# EAGLE schematic snake_game (EAGLE 6.3)
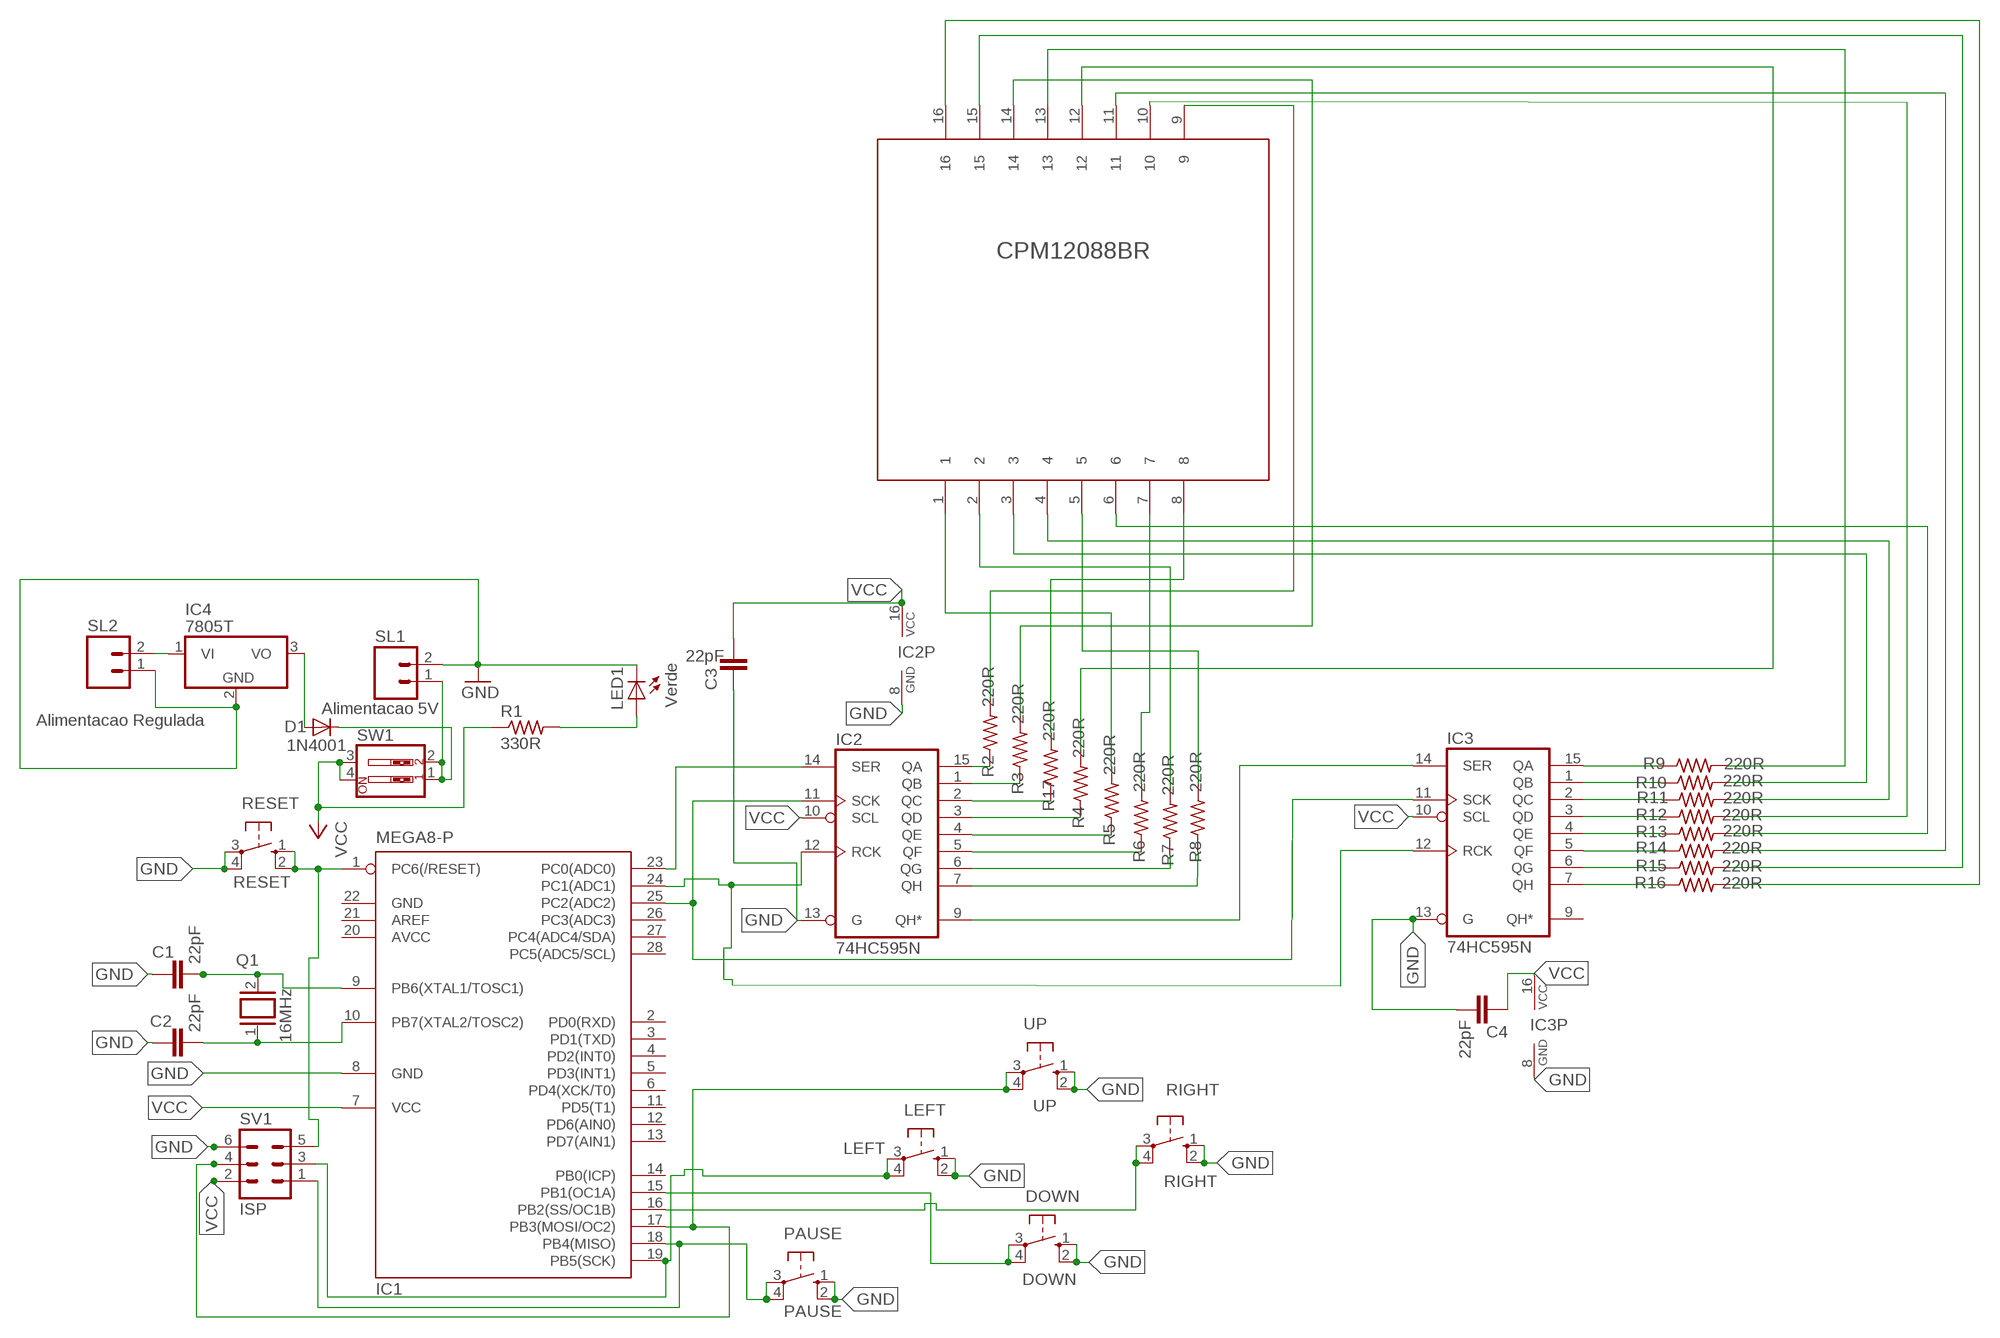
[diagram p0: schematic, sheet 1]

## Parts
C1  22pF  C2.5/2  [C2.5-2]
C2  22pF  C2.5/2  [C2.5-2]
C3  22pF  C2.5/2  [C2.5-2]
C4  22pF  C2.5/2  [C2.5-2]
D1  1N4001  1N4004  [DO41-10]
DOWN  DOWN  10-XX  [B3F-10XX]
IC1  MEGA8-P  [DIL28-3]
IC2  74HC595N  [DIL16]
IC3  74HC595N  [DIL16]
IC4  7805T  [TO220H]
LED1  Verde  LED3MM  [LED3MM]
LEFT  LEFT  10-XX  [B3F-10XX]
MTX1  LED_DOT_MATRIX_8X8_CPM12088B  [MATRIX_8X8_CPM12088B]
PAUSE  PAUSE  10-XX  [B3F-10XX]
Q1  16MHz  XTAL/S  [QS]
R1  330R  R-US_0207/10  [0207/10]
R2  220R  R-US_0207/10  [0207/10]
R3  220R  R-US_0207/10  [0207/10]
R4  220R  R-US_0207/10  [0207/10]
R5  220R  R-US_0207/10  [0207/10]
R6  220R  R-US_0207/10  [0207/10]
R7  220R  R-US_0207/10  [0207/10]
R8  220R  R-US_0207/10  [0207/10]
R9  220R  R-US_0207/10  [0207/10]
R10  220R  R-US_0207/10  [0207/10]
R11  220R  R-US_0207/10  [0207/10]
R12  220R  R-US_0207/10  [0207/10]
R13  220R  R-US_0207/10  [0207/10]
R14  220R  R-US_0207/10  [0207/10]
R15  220R  R-US_0207/10  [0207/10]
R16  220R  R-US_0207/10  [0207/10]
R17  220R  R-US_0207/10  [0207/10]
RESET  RESET  10-XX  [B3F-10XX]
RIGHT  RIGHT  10-XX  [B3F-10XX]
SL1  Alimentacao 5V  M02  [02P]
SL2  Alimentacao Regulada  M02  [02P]
SV1  ISP  ML6  [ML6]
SW1  SW_DIP-2  [EDG-02]
UP  UP  10-XX  [B3F-10XX]

## Nets
GND: C1.1 C2.1 C3.1 C4.2 DOWN.1(S) DOWN.2(S1) IC1.8(GND) IC2.8(GND) IC2.13(G) IC3.8(GND) IC3.13(G) IC4.2(GND) LED1.K(C) LEFT.1(S) LEFT.2(S1) PAUSE.1(S) PAUSE.2(S1) RESET.3(P) RESET.4(P1) RIGHT.1(S) RIGHT.2(S1) SL1.2 SL2.1 SV1.6 UP.1(S) UP.2(S1)
N$1: MTX1.9 R2.2
N$2: IC1.1(PC6(/RESET)) RESET.1(S) RESET.2(S1) SV1.5
N$3: C2.2 IC1.10(PB7(XTAL2/TOSC2)) Q1.1
N$4: C1.2 IC1.9(PB6(XTAL1/TOSC1)) Q1.2
N$5: IC1.19(PB5(SCK)) LEFT.3(P) LEFT.4(P1) SV1.3
N$7: DOWN.3(P) DOWN.4(P1) IC1.15(PB1(OC1A))
N$9: IC1.16(PB2(SS/OC1B)) RIGHT.3(P) RIGHT.4(P1)
N$11: IC1.17(PB3(MOSI/OC2)) SV1.4 UP.3(P) UP.4(P1)
N$12: IC4.1(VI) SL2.2
N$13: IC1.18(PB4(MISO)) PAUSE.3(P) PAUSE.4(P1) SV1.1
N$14: D1.A IC4.3(VO)
N$15: IC1.23(PC0(ADC0)) IC2.14(SER)
N$16: IC1.24(PC1(ADC1)) IC2.12(RCK) IC3.12(RCK)
N$17: IC1.25(PC2(ADC2)) IC2.11(SCK) IC3.11(SCK)
N$18: D1.C SL1.1 SW1.1 SW1.2
N$19: LED1.A R1.2
N$20: IC2.9(QH*) IC3.14(SER)
N$21: MTX1.14 R3.2
N$22: MTX1.8 R17.2
N$23: MTX1.12 R4.2
N$24: MTX1.1 R5.2
N$25: MTX1.7 R6.2
N$26: MTX1.2 R7.2
N$27: IC2.7(QH) R8.1
N$28: MTX1.13 R9.2
N$29: MTX1.3 R10.2
N$30: MTX1.4 R11.2
N$31: MTX1.10 R12.2
N$32: MTX1.6 R13.2
N$33: MTX1.11 R14.2
N$34: MTX1.15 R15.2
N$35: MTX1.16 R16.2
N$36: IC3.7(QH) R16.1
N$37: IC2.15(QA) R2.1
N$38: IC3.6(QG) R15.1
N$39: IC3.5(QF) R14.1
N$40: IC3.4(QE) R13.1
N$41: IC3.3(QD) R12.1
N$42: IC3.2(QC) R11.1
N$43: IC3.1(QB) R10.1
N$44: IC3.15(QA) R9.1
N$45: IC2.1(QB) R3.1
N$46: IC2.3(QD) R4.1
N$47: IC2.4(QE) R5.1
N$48: IC2.5(QF) R6.1
N$49: IC2.6(QG) R7.1
N$50: MTX1.5 R8.2
N$51: IC2.2(QC) R17.1
VCC: C3.2 C4.1 IC1.7(VCC) IC2.10(SCL) IC2.16(VCC) IC3.10(SCL) IC3.16(VCC) R1.1 SV1.2 SW1.3 SW1.4
Unconnected: IC1.2(PD0(RXD)) IC1.3(PD1(TXD)) IC1.4(PD2(INT0)) IC1.5(PD3(INT1)) IC1.6(PD4(XCK/T0)) IC1.11(PD5(T1)) IC1.12(PD6(AIN0)) IC1.13(PD7(AIN1)) IC1.14(PB0(ICP)) IC1.21(AREF) IC1.26(PC3(ADC3)) IC1.27(PC4(ADC4/SDA)) IC1.28(PC5(ADC5/SCL)) IC3.9(QH*)

## Power pins joined to a net without a drawn wire
AVCC: IC1.20(AVCC)
GND: IC1.22(GND)

## Library data of the parts
C1-C4 = capacitor-wima:C: CAPACITOR naming: grid - package width
D1 = diode:1N4004: DIODE general purpose rectifier, 1 A
DOWN LEFT PAUSE RESET RIGHT UP = switch-omron:10-XX: OMRON SWITCH; MPN: B3F-1000; OC_FARNELL: 176432; OC_NEWARK: 36M3542
IC1 = atmel:MEGA8-P: MICROCONTROLLER 8 Kbytes FLASH, 1 kbytes SRAM, 512 bytes EEPROM, USART, 4-channel 10 bit ADC, 2-channel 8 bit ADC Pin compatible with Atmega48, ATMega88, ATMega168 Source: avr.lbr; OC_FARNELL: unknown; OC_NEWARK: unknown
IC2 IC3 = 74xx-eu:74*595: 8-bit SHIFT REGISTER, output latch
IC4 = linear:78*: Positive VOLTAGE REGULATOR Source: http://cache.national.com/ds/LM/LM78L05.pdf http://www.fairchildsemi.com/ds/LM/LM7805.pdf
LED1 = led:LED: LED OSRAM: - CHIPLED LG R971, LG N971, LY N971, LG Q971, LY Q971, LO R971, LY R971 LH N974, LH R974 LS Q976, LO Q976, LY Q976 LO Q996 - Hyper CHIPLED LW Q18S LB Q993, LB Q99A, LB R99A - SideLED LS A670, LO A670, LY A670, LG A670, LP A670 LB A673, LV A673, LT A673, LW A673 LH A674 LY A675 LS A676, LA A676, LO A676, LY A676, LW A676 LS A679, LY A679, LG A679 - Hyper Micro SIDELED® LS Y876, LA Y876, LO Y876, LY Y876 LT Y87S - SmartLED LW L88C, LW L88S LB L89C, LB L89S, LG L890 LS L89K, LO L89K, LY L89K LS L896, LA L896, LO L896, LY L896 - TOPLED LS T670, LO T670, LY T670, LG T670, LP T670 LSG T670, LSP T670, LSY T670, LOP T670, LYG T670 LG T671, LOG T671, LSG T671 LB T673, LV T673, LT T673, LW T673 LH T674 LS T676, LA T676, LO T676, LY T676, LB T676, LH T676, LSB T676, LW T676 LB T67C, LV T67C, LT T67C, LS T67K, LO T67K, LY T67K, LW E67C LS E67B, LA E67B, LO E67B, LY E67B, LB E67C, LV E67C, LT E67C LW T67C LS T679, LY T679, LG T679 LS T770, LO T770, LY T770, LG T770, LP T770 LB T773, LV T773, LT T773, LW T773 LH T774 LS E675, LA E675, LY E675, LS T675 LS T776, LA T776, LO T776, LY T776, LB T776 LHGB T686 LT T68C, LB T68C - Hyper Mini TOPLED® LB M676 - Mini TOPLED Santana® LG M470 LS M47K, LO M47K, LY M47K Source: http://www.osram.convergy.de LUXEON: - LUMILED® LXK2-PW12-R00, LXK2-PW12-S00, LXK2-PW14-U00, LXK2-PW14-V00 LXK2-PM12-R00, LXK2-PM12-S00, LXK2-PM14-U00 LXK2-PE12-Q00, LXK2-PE12-R00, LXK2-PE12-S00, LXK2-PE14-T00, LXK2-PE14-U00 LXK2-PB12-K00, LXK2-PB12-L00, LXK2-PB12-M00, LXK2-PB14-N00, LXK2-PB14-P00, LXK2-PB14-Q00 LXK2-PR12-L00, LXK2-PR12-M00, LXK2-PR14-Q00, LXK2-PR14-R00 LXK2-PD12-Q00, LXK2-PD12-R00, LXK2-PD12-S00 LXK2-PH12-R00, LXK2-PH12-S00 LXK2-PL12-P00, LXK2-PL12-Q00, LXK2-PL12-R00 Source: www.luxeon.com KINGBRIGHT: KA-3528ASYC Source: www.kingbright.com
MTX1 = leddotmatrix8x8:LED_DOT_MATRIX_8X8_CPM12088B: LED DOT MATRIX 8x8 COMMON ANODE Wuxi Compul Electronics Model: CPM12088BR Flávio Oliveira
Q1 = special:XTAL/S: CRYSTAL
R1-R17 = rcl:R-US_: RESISTOR, American symbol
SL1 SL2 = con-amp-quick:M02: AMP QUICK CONNECTOR; OC_FARNELL: unknown; OC_NEWARK: unknown
SV1 = con-ml:ML6: HARTING; OC_FARNELL: unknown; OC_NEWARK: unknown
SW1 = special:SW_DIP-2: DIP SWITCH